# Altium schematic sheet Mother_board_sauvc_2025.SchDoc
size A4; SheetNumber: 1; SheetTotal: 4
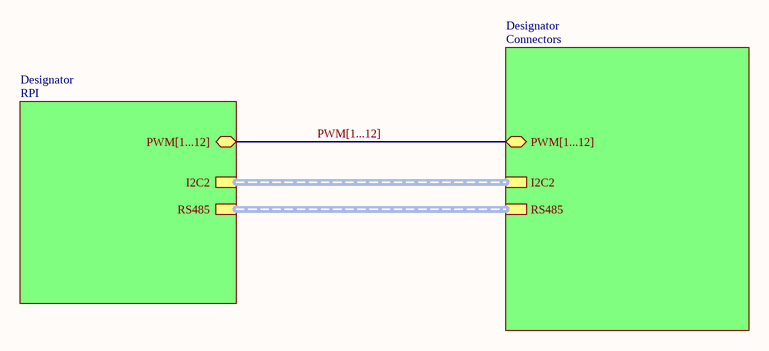
[diagram p0: Mother_board_sauvc_2025.SchDoc]

## Sub-sheets
Designator = RPI: PWM[1...12] (bidir), I2C2 (harness *), RS485 (harness *)
Designator = Connectors: PWM[1...12] (bidir), I2C2 (harness *), RS485 (harness *)

## Buses and harness runs
bus PWM[1...12] = sheet Designator/PWM[1...12]